# EAGLE design tix_clock (EAGLE 7.4.0)
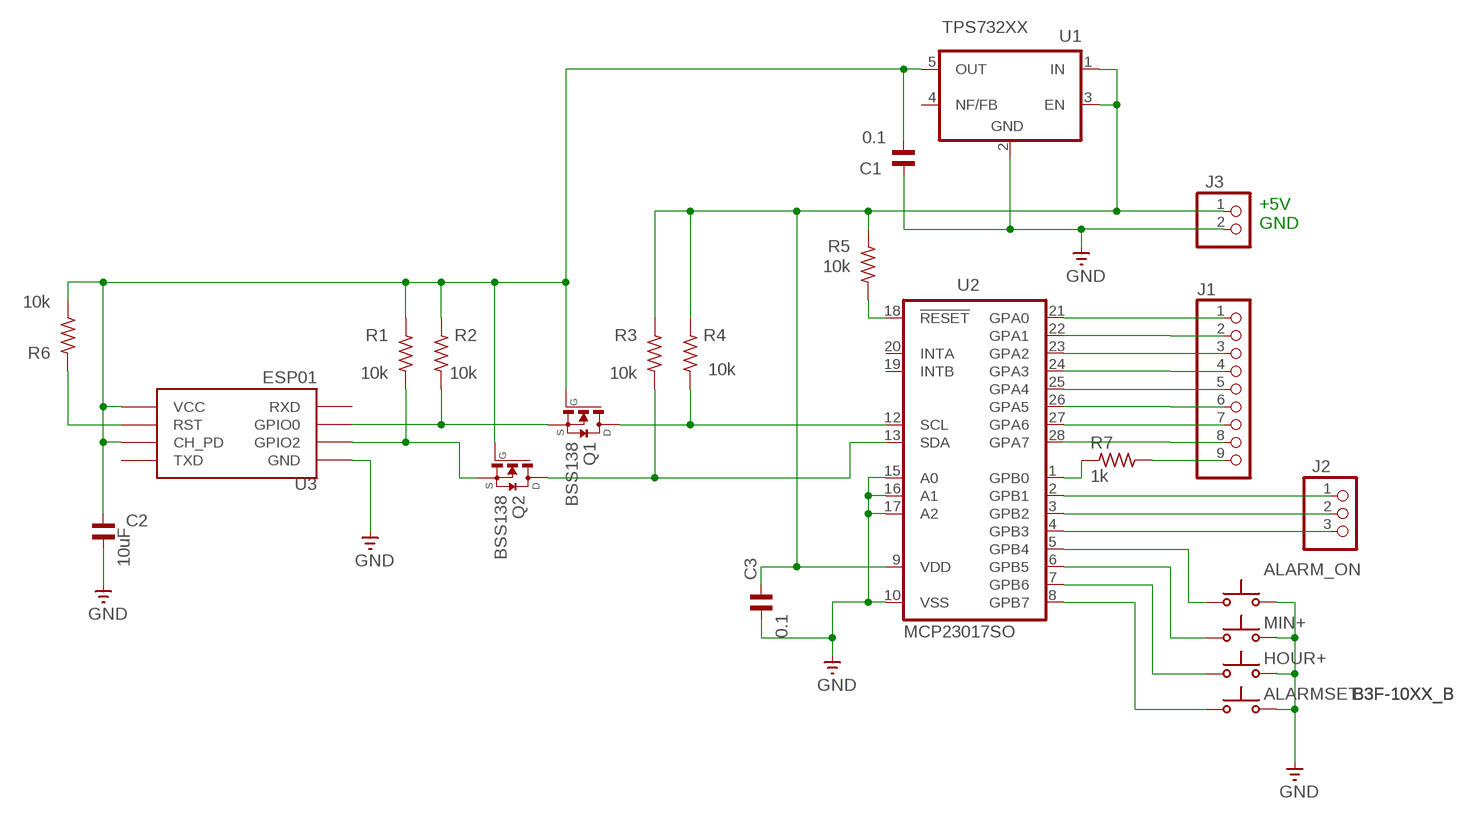
[diagram p0: schematic, sheet 1]

## Parts
ALARM_ON  B3F-10XX_B  [B3F-10XX_B]
ALARMSET  B3F-10XX_B  [B3F-10XX_B]
C1  0.1  C-USC0805  [C0805]
C2  10uF  C-USC0805  [C0805]
C3  0.1  C-USC0805  [C0805]
HOUR+  B3F-10XX_B  [B3F-10XX_B]
J1  PINHD-1X9  [1X09]
J2  PINHD-1X3  [1X03]
J3  PINHD-1X2  [1X02]
MIN+  B3F-10XX_B  [B3F-10XX_B]
Q1  BSS138  [SOT23]
Q2  BSS138  [SOT23]
R1  10k  R_0805  [R0805]
R2  10k  R_0805  [R0805]
R3  10k  R_0805  [R0805]
R4  10k  R_0805  [R0805]
R5  10k  R_0805  [R0805]
R6  10k  R_0805  [R0805]
R7  1k  R-US_R0805  [R0805]
U1  TPS732XX  [SOT23-5]
U2  MCP23017SO  [SO28W]
U3  ESP01  [ESP01]

## Nets
GND: ALARM_ON.3(S) ALARM_ON.4(S) ALARMSET.3(S) ALARMSET.4(S) C1.2 C2.2 C3.2 HOUR+.3(S) HOUR+.4(S) J3.2 MIN+.3(S) MIN+.4(S) U1.2(GND) U2.10(VSS) U2.15(A0) U2.16(A1) U2.17(A2) U3.GND
N$1: J1.1 U2.21(GPA0)
N$2: J1.2 U2.22(GPA1)
N$3: J1.3 U2.23(GPA2)
N$4: J1.4 U2.24(GPA3)
N$5: J1.5 U2.25(GPA4)
N$6: J1.6 U2.26(GPA5)
N$7: J1.7 U2.27(GPA6)
N$8: J1.8 U2.28(GPA7)
N$9: J1.9 R7.2
N$10: J2.1 U2.2(GPB1)
N$11: J2.2 U2.3(GPB2)
N$12: J2.3 U2.4(GPB3)
N$13: ALARM_ON.1(P) ALARM_ON.2(P) U2.5(GPB4)
N$14: MIN+.1(P) MIN+.2(P) U2.6(GPB5)
N$15: HOUR+.1(P) HOUR+.2(P) U2.7(GPB6)
N$16: ALARMSET.1(P) ALARMSET.2(P) U2.8(GPB7)
N$17: R7.1 U2.1(GPB0)
N$18: Q1.3(D) R4.1 U2.12(SCL)
N$19: Q2.3(D) R3.1 U2.13(SDA)
N$20: Q1.2(S) R2.1 U3.GPIO0
N$21: Q2.2(S) R1.1 U3.GPIO2
N$23: R5.1 U2.18(!RESET)
N$24: R6.1 U3.RST
VCC [VCC]: C1.1 C2.1 Q1.1(G) Q2.1(G) R1.2 R2.2 R6.2 U1.5(OUT) U3.CH_PD U3.VCC
VDD: C3.1 J3.1 R3.2 R4.2 R5.2 U1.1(IN) U1.3(EN) U2.9(VDD)
Unconnected: U1.4(NF/FB) U2.19(INTB) U2.20(INTA) U3.RX(RXD) U3.TX(TXD)

## Notes on the sheet
- +5V
  GND

## Library data of the parts
ALARM_ON ALARMSET HOUR+ MIN+ = switch-omron:B3F-10XX: Tactile Switch
C1-C3 = rcl:C-US: CAPACITOR, American symbol
J1 = pinhead:PINHD-1X9: PIN HEADER
J2 = pinhead:PINHD-1X3: PIN HEADER
J3 = pinhead:PINHD-1X2: PIN HEADER
Q1 Q2 = transistor-fet:BSS138*: Power MOSFET
R1-R6 = rc-master-smd:R_: RESISTOR
R7 = rcl:R-US_: RESISTOR, American symbol
U1 = v-reg:TPS732XX: LDO REGULATOR
U2 = microchip:MCP23017: I/O Expander Source: http://ww1.microchip.com/downloads/en/DeviceDoc/21952a.pdf
U3 = esp8266modules:ESP01: ESP8266 Wifi module 01

## Net classes
1 VCC: width 0.406 mm

## Board
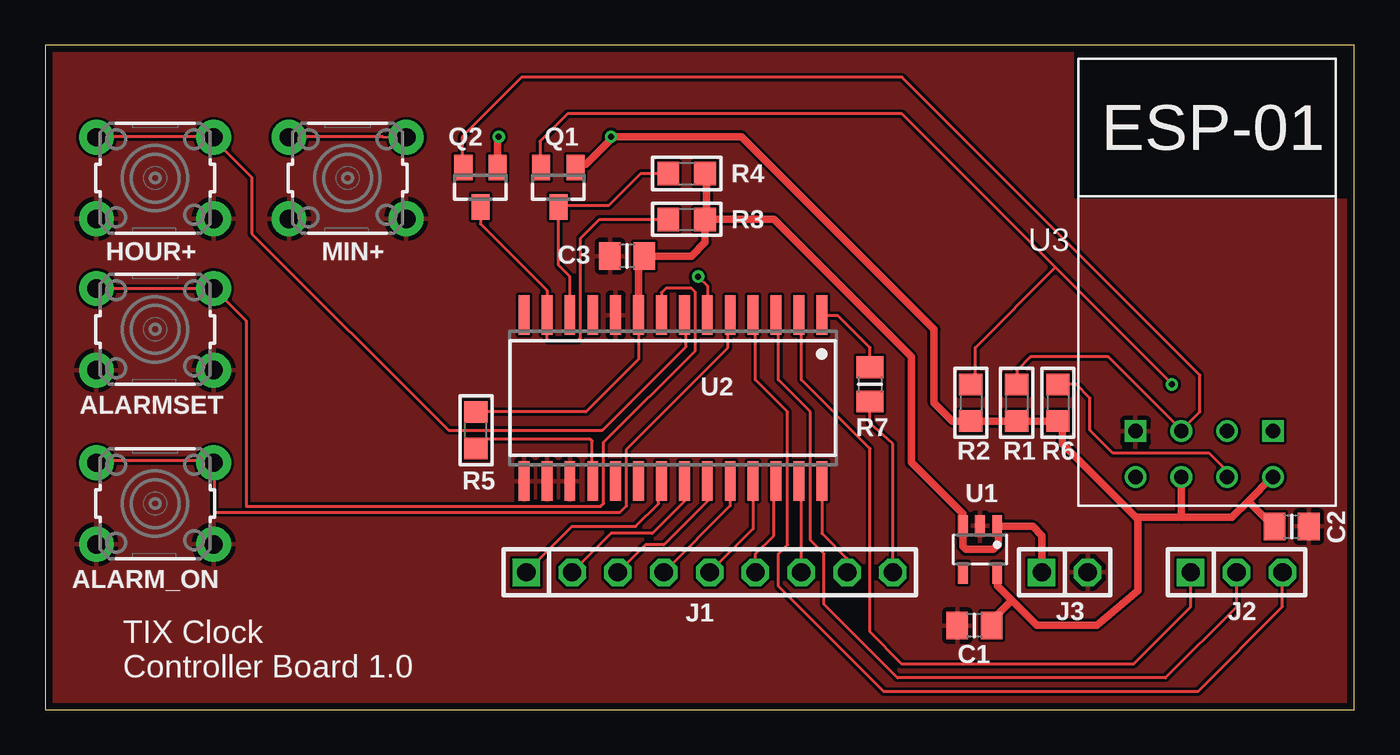
[diagram p1: board, top side]
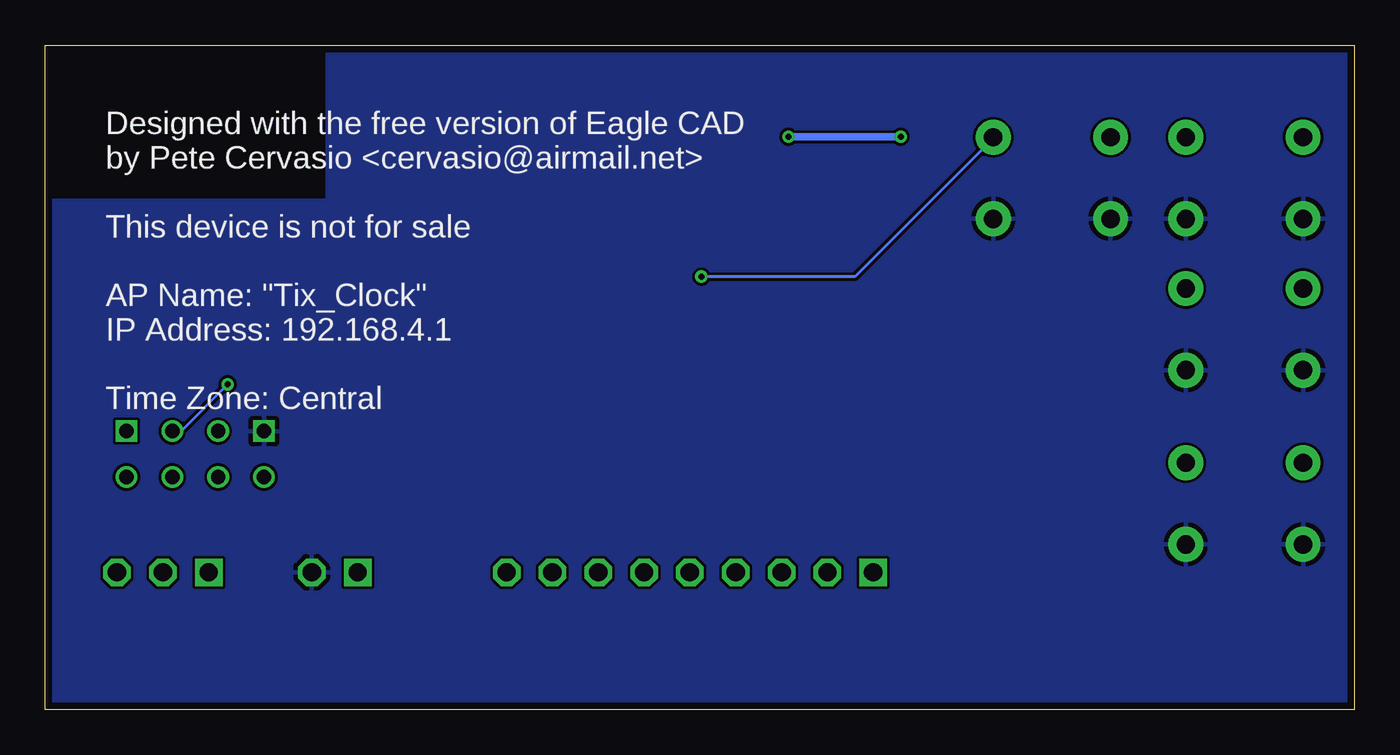
[diagram p2: board, bottom side, seen from below]

Size 72.57 x 36.83 mm. Coordinates in mm from the lower left corner, seen from the top.
Outline: 0,0 72.57,0 72.57,36.82 63.75,36.82 63.75,36.83 0,36.82 0,0
Copper layers (1*16): Top 0.0356mm / dielectric 1.5011mm / Bottom 0.0356mm
Design rules "LaenPCBOrder": minimum track width 6mil, minimum drill 13mil, track to track 6mil, track to pad 6mil, pad to pad 6mil, via to via 6mil, smd to smd 6mil, copper to edge 15mil, drill to drill 6mil, minimum pad ring 7mil, minimum via ring 7mil, stop-mask expansion 3mil, vias tented up to drill 0mil, thermal gap 10mil
tRestrict: area 44.9,17.8 to 45.5,18.3; area 45.9,17.8 to 46.5,18.3

### Footprints (pad centres in the part's own frame; a part is rotated, then mirrored left to right if it is on the bottom)
B3F-10XX_B = drill 1.016 pad 1.93: 1 -3.251,2.261; 2 3.251,2.261; 3 -3.251,-2.261; 4 3.251,-2.261
C0805 = smd 1.2 x 1.5: 1 -0.953,0; 2 0.953,0
1X09 = drill 1.016 square: 1 -10.16,0 | drill 1.016 octagon: 2 -7.62,0; 3 -5.08,0; 4 -2.54,0; 5 0,0; 6 2.54,0; 7 5.08,0; 8 7.62,0; 9 10.16,0
1X03 = drill 1.016 square: 1 -2.54,0 | drill 1.016 octagon: 2 0,0; 3 2.54,0
1X02 = drill 1.016 square: 1 -1.27,0 | drill 1.016 octagon: 2 1.27,0
SOT23 = smd 1 x 1.4: 1 -0.95,-1.1; 2 0.95,-1.1; 3 0,1.1
R0805 = smd 1.2 x 1.3: 1 -1.016,0; 2 1.016,0
R0805' = smd 1.2 x 1.5: 1 -0.953,0; 2 0.953,0
SOT23-5 = smd 0.55 x 1.2: 1 -0.95,-1.3; 2 0,-1.3; 3 0.95,-1.3; 4 0.95,1.3; 5 -0.95,1.3
SO28W = smd 0.6 x 2.2: 1 -8.255,-4.6; 2 -6.985,-4.6; 3 -5.715,-4.6; 4 -4.445,-4.6; 5 -3.175,-4.6; 6 -1.905,-4.6; 7 -0.635,-4.6; 8 0.635,-4.6; 9 1.905,-4.6; 10 3.175,-4.6; 11 4.445,-4.6; 12 5.715,-4.6; 13 6.985,-4.6; 14 8.255,-4.6; 15 8.255,4.6; 16 6.985,4.6; 17 5.715,4.6; 18 4.445,4.6; 19 3.175,4.6; 20 1.905,4.6; 21 0.635,4.6; 22 -0.635,4.6; 23 -1.905,4.6; 24 -3.175,4.6; 25 -4.445,4.6; 26 -5.715,4.6; 27 -6.985,4.6; 28 -8.255,4.6
ESP01 = drill 0.8: CH_PD -1.285,-8.178; GPIO0 1.255,-5.638; GPIO2 -1.285,-5.638; RST 1.255,-8.178; TX -3.825,-8.178; VCC 3.795,-8.178 | drill 0.8 square: GND -3.825,-5.638; RX 3.795,-5.638

### Placement (x,y rotation side)
ALARM_ON  6.1,11.43 0 top
ALARMSET  6.1,21.08 0 top
C1  51.51,4.67 180 top
C2  69.09,10.16 0 top
C3  32.26,25.15 180 top
HOUR+  6.1,29.46 0 top
J1  36.83,7.62 0 top
J2  66.04,7.62 0 top
J3  56.52,7.62 0 top
MIN+  16.76,29.46 0 top
Q1  28.45,28.96 180 top
Q2  24.13,28.96 180 top
R1  53.85,17.02 270 top
R2  51.31,17.02 270 top
R3  35.56,27.18 0 top
R4  35.56,29.72 0 top
R5  23.88,15.49 90 top
R6  56.13,17.02 270 top
R7  1k  [R0805']  45.72,18.03 270 top
U1  51.82,8.89 180 top
U2  34.8,17.27 180 top
U3  64.26,21.08 0 top

### Tracks (layer width: path | path; a pad name or v marks a point on that pad's centre or on a via)
GND
  pour Bottom: 0,0 0,36.83 56.9,36.83 56.9,28.19 72.39,28.19 72.39,0
  pour Top: 0,-0.13 0,36.83 56.9,36.83 56.9,28.19 72.39,28.19 72.39,0
N$1
  Top 0.152: U2.21 34.13,12.54 34,11.91 34,11.43 32.73,10.16 29.21,10.16 J1.1
N$2
  Top 0.152: U2.22 35.43,11.56 33.66,9.78 31.37,9.78 J1.2
N$3
  Top 0.152: U2.23 36.7,11.56 34.29,9.14 33.27,9.14 J1.3
N$4
  Top 0.152: U2.24 37.97,11.3 J1.4
N$5
  Top 0.152: U2.25 39.24,10.03 J1.5
N$6
  Top 0.152: J1.6 39.37,8.64 40.39,9.65 40.39,12.54 U2.26
N$7
  Top 0.152: 41.91,12.54 U2.27 41.91,12.54 J1.7
N$8
  Top 0.152: U2.28 43.05,9.78 44.45,8.38 J1.8
N$9
  Top 0.152: J1.9 46.99,14.73 45.72,15.88 R7.2
N$10
  Top 0.152: U2.2 41.91,21.75 41.91,18.29 45.72,14.48 45.72,4.32 47.5,2.54 60.33,2.54 63.5,5.71 J2.1
N$11
  Top 0.152: U2.3 40.64,21.75 40.64,18.29 42.42,16.51 42.42,9.4 43.18,8.64 43.18,5.84 47.24,1.78 62.1,1.78 66.04,5.71 J2.2
N$12
  Top 0.152: U2.4 39.37,21.75 39.37,18.29 41.15,16.51 41.15,9.14 40.64,8.64 40.64,6.86 46.48,1.02 63.88,1.02 68.58,5.71 J2.3
N$13
  Top 0.152: 37.94,21.75 U2.5 | ALARM_ON.1 2.86,13.81 9.21,13.81 ALARM_ON.2 9.37,13.65 9.37,10.95 31.88,10.95 32.23,11.3 32.23,14.45 37.85,20.07 37.85,21.75 U2.5 | 38.1,21.75 U2.5
N$14  (via drill 0.33)
  Top 0.152: 36.67,21.91 U2.6 | 13.46,31.75 18.73,31.75 MIN+.2 | 13.46,31.75 13.4,31.75 | 36.58,22 U2.6 | MIN+.1 13.49,31.73 13.46,31.75 | v36.2,24 36.7,23.5 U2.6
  Bottom 0.152: MIN+.2 20.02,31.67 27.69,24 v36.2,24
N$15
  Top 0.152: 35.4,21.75 U2.7 35.53,21.78 35.53,20.13 30.89,15.49 22.35,15.49 11.46,26.38 11.46,29.5 9.37,31.59 HOUR+.2 9.21,31.75 2.86,31.75 HOUR+.1
N$16
  Top 0.152: 34.29,21.91 U2.8 34.16,23.11 34.42,23.37 35.81,23.37 36.04,23.15 36.04,19.91 30.96,14.83 30.96,11.43 30.8,11.27 11.14,11.27 11.14,21.56 9.37,23.34 ALARMSET.2 9.21,23.34 2.86,23.34 ALARMSET.1
N$17
  Top 0.152: R7.1 45.72,20.07 43.94,21.84 43.08,21.84 U2.1
N$18
  Top 0.152: 34.45,29.84 R4.1 33.02,29.72 31.24,27.94 28.53,27.94 Q1.3 | Q1.3 28.45,27.69 | U2.12 29.08,24 28.45,24.64 Q1.3
N$19
  Top 0.152: 34.45,27.15 R3.1 30.73,27.18 29.69,26.13 29.69,20.64 29.53,20.48 27.91,20.48 27.81,20.57 U2.13 | 27.94,21.75 U2.13 | Q2.3 24.13,26.92 27.81,23.24 U2.13
N$20  (via drill 0.33)
  Top 0.152: 27.62,30 Q1.2 27.43,30.12 27.43,31.5 28.96,33.02 47.5,33.02 56.01,24.51 | v62.45,18.03 62.45,18.07 56.01,24.51 | R2.1 51.56,18.29 51.56,20.07 56.01,24.51
  Bottom 0.152: v62.45,18.03 64.93,15.56 65.41,15.56 U3.GPIO0
N$21
  Top 0.152: 62.98,15.48 62.98,15.51 58.93,19.56 54.61,19.56 53.85,18.8 R1.1 | U3.GPIO2 62.98,15.48 | 62.98,15.48 64.01,16.51 64.01,18.54 47.5,35.05 26.42,35.05 23.11,31.75 23.11,30.12 Q2.2
N$23
  Top 0.152: 23.97,14.45 R5.1 24.38,14.99 30.23,14.99 30.32,14.89 30.32,12.7 U2.18
N$24
  Top 0.152: U3.RST 65.52,13.22 64.52,14.22 59.18,14.22 57.91,15.49 57.91,17.27 57.15,18.03 R6.1
VCC  (via drill 0.33)
  Top 0.406: 31.4,31.66 v31.37,31.75 | 29.37,30.16 Q1.1 29.57,30.23 29.97,30.23 31.37,31.62 v31.37,31.75 | 68.1,12.86 U3.VCC 68.02,12.9 66.67,11.56 | 66.67,11.56 65.79,10.67 62.99,10.67 | 62.99,10.67 60.58,10.67 | U3.CH_PD 62.98,10.68 62.99,10.67 | 52.81,7.59 U1.5 52.78,7.58 52.78,6.88 53.58,6.08 | C2.1 68.07,10.16 66.67,11.56 | 53.58,6.08 54.97,4.7 58.29,4.7 60.58,6.6 60.58,10.67 | 60.58,10.67 60.45,10.67 56.39,14.73 56.39,15.75 R6.2 R1.2 R2.2 50.29,16 49.28,17.02 49.28,21.08 38.61,31.75 v31.37,31.75 | Q2.1 25.08,31.61 v25.15,31.75 | C1.1 52.46,4.97 53.58,6.08
  Bottom 0.406: v31.37,31.75 v25.15,31.75
VDD
  Top 0.152: 52.86,10.16 U1.1 | 36.67,27.3 R3.2 36.51,27.15 | 36.67,29.69 R4.2 | 32.89,21.91 U2.9 32.89,19.43 29.97,16.51 R5.2
  Top 0.406: 36.67,29.69 36.67,27.3 | J3.1 55.24,9.65 54.74,10.16 52.8,10.16 U1.1 52.83,10.12 52.83,9.14 52.55,8.89 51.03,8.89 50.87,9.08 U1.3 50.87,10.86 48.01,13.72 48.01,19.56 40.39,27.18 R3.2 36.58,25.91 35.81,25.15 C3.1 32.89,24.83 32.89,21.91

### Text on the board
_tsilk: TIX Clock / Controller Board 1.0
_bsilk: Designed with the free version of Eagle CAD / by Pete Cervasio <cervasio@airmail.net> / / This device is not for sale / / AP Name: "Tix_Clock" / IP Address: 192.168.4.1 / / Time Zone: Central